# EasyEDA Pro project ProPrj_PomoDesk_V1.0.epro, board PCB1
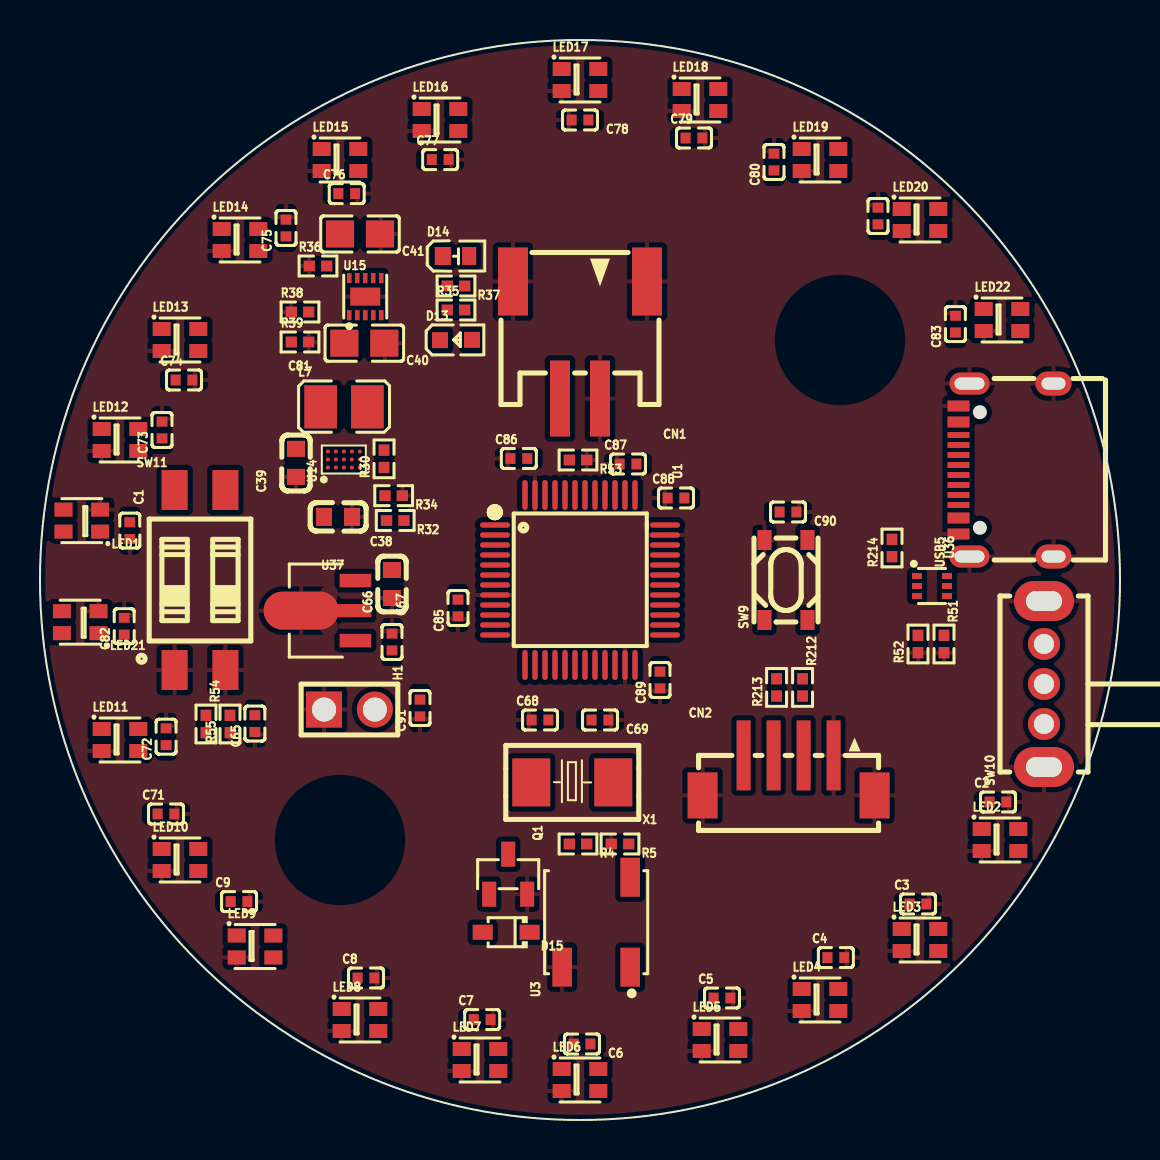
[diagram p5: board, top side]
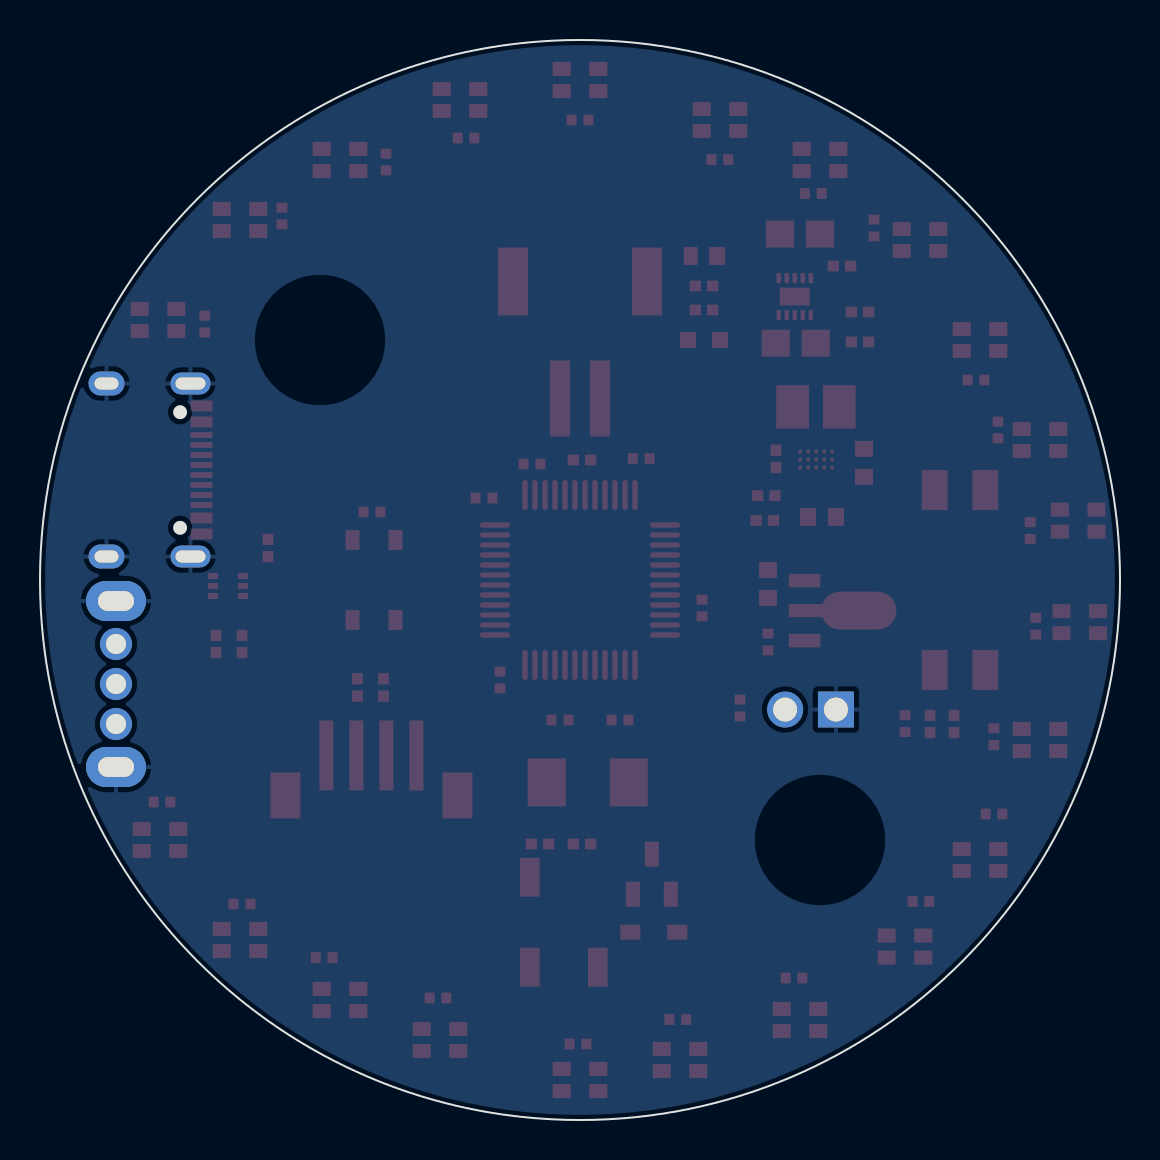
[diagram p6: board, bottom side, seen from below]

Outline 54 x 54 mm; copper layers: Top Layer, Inner1, Inner2, Bottom Layer. Coordinates in mm from the lower left corner of the outline.
Outline path: 0,27 arc(7.91,46.09) 27,54 arc(46.09,46.09) 54,27 arc(46.09,7.91) 27,0 arc(7.91,7.91) 0,27
Stack: Top Layer 0.035mm Outer layer thickness 1oz / Dielectric1 0.2104mm 7628 RC49% 8.6mil / Inner1 0.0152mm Inner layer thickness / Dielectric2 1.065mm 1.1mm H/HOZ Copper / Inner2 0.0152mm Inner layer thickness / Dielectric3 0.2104mm 7628 RC49% 8.6mil / Bottom Layer 0.035mm Outer layer thickness 1oz

## Design rules (mm)
template: JLCPCB Capability(Two Layers Board)
spacing copperThickness1oz (default): track to track 0.102, other pairs 0.152 to 0.3
spacing copperThickness2oz: track to track 0.203, other pairs 0.152 to 0.3
track width copperThickness1oz (default): min 0.127, default 0.254, max 2.54
track width copperThickness2oz: min 0.203, default 0.254, max 2.54
differential pair differentialPair (default): width min 0.127, default 0.254, max 2.54; gap min 0.152, default 0.152
via viaSize (default): diameter min 0.5, default 0.61, max 10; hole min 0.3, default 0.305, max 6.3

## Placement (name value [footprint] x y rotation side)
C1  100nF  [C0402]  4.49 29.47 270 top
C2  100nF  [C0402]  47.9 15.9 0 top
C3  100nF  [C0402]  43.9 10.8 0 top
C4  100nF  [C0402]  39.79 8.12 0 top
C5  100nF  [C0402]  34.1 6.1 0 top
C6  100nF  [C0402]  27.1 3.8 180 top
C7  100nF  [C0402]  22.11 5.02 0 top
C8  100nF  [C0402]  16.3 7.1 0 top
C9  100nF  [C0402]  9.95 10.92 0 top
C38  10uF  [C0603]  14.9 30.16 180 top
C39  22uF  [C0603]  12.8 32.86 90 top
C40  1uF  [C0805]  16.22 38.84 180 top
C41  1uF  [C0805]  16 44.3 180 top
C65  10nF  [C0402]  10.74 19.82 90 top
C66  330nF  [C0603]  17.6 26.8 90 top
C67  100nF  [C0402]  17.6 23.9 270 top
C68  20pF  [C0402]  25 20 0 top
C69  20pF  [C0402]  28 20 180 top
C71  100nF  [C0402]  6.3 15.3 0 top
C72  100nF  [C0402]  6.3 19.17 90 top
C73  100nF  [C0402]  6.1 34.5 90 top
C74  100nF  [C0402]  7.2 37 0 top
C75  100nF  [C0402]  12.3 44.6 90 top
C76  100nF  [C0402]  15.34 46.32 0 top
C77  100nF  [C0402]  20.01 48.02 0 top
C78  100nF  [C0402]  27 50 180 top
C79  100nF  [C0402]  32.7 49.1 0 top
C80  100nF  [C0402]  36.7 47.9 90 top
C81  100nF  [C0402]  41.9 45.2 90 top
C82  100nF  [C0402]  4.21 24.69 90 top
C83  100nF  [C0402]  45.77 39.8 90 top
C85  100nF  [C0402]  20.9 25.6 90 top
C86  100nF  [C0402]  23.94 33.08 0 top
C87  100nF  [C0402]  29.4 32.8 0 top
C88  100nF  [C0402]  31.8 31.1 0 top
C89  100nF  [C0402]  31 22 90 top
C90  100nF  [C0402]  37.4 30.4 180 top
C91  100nF  [C0402]  19 20.6 90 top
CN1  S2B-PH-SM4  [CONN-SMD_P2.00_S2B-PH-SM4-TB-LF-SN]  27 39 180 top
CN2  B4B-ZR-SM4-TFT(LF)(SN)  [CONN-TH_B4B-ZR-SM4-TFT-LF-SN]  37.43 17.23 0 top
D13  19-217/GHC-YR1S2/6T  [LED0603-RD_GREEN]  20.8 39 0 top
D14  19-217/BHC-ZL1M2RY/6T  [LED0603-R-RD_BLUE-A]  20.8 43.2 0 top
D15  1N4148WS  [SOD-323_L1.8-W1.3-LS2.5-RD]  23.31 9.39 180 top
H1  -  [HDR-TH_2P-P2.54-V-M-2]  15.47 20.52 270 top
L7  470nH  [L1008]  15.2 35.66 0 top
LED1  WS2812B-2020  [LED-SMD_4P-L2.0-W2.0-TL_WS2812B-2020]  2.09 29.97 180 top
LED2  WS2812B-2020  [LED-SMD_4P-L2.0-W2.0-TL_WS2812B-2020]  48 14 0 top
LED3  WS2812B-2020  [LED-SMD_4P-L2.0-W2.0-TL_WS2812B-2020]  44 9 0 top
LED4  WS2812B-2020  [LED-SMD_4P-L2.0-W2.0-TL_WS2812B-2020]  39 6 0 top
LED5  WS2812B-2020  [LED-SMD_4P-L2.0-W2.0-TL_WS2812B-2020]  34 4 0 top
LED6  WS2812B-2020  [LED-SMD_4P-L2.0-W2.0-TL_WS2812B-2020]  27 2 0 top
LED7  WS2812B-2020  [LED-SMD_4P-L2.0-W2.0-TL_WS2812B-2020]  22 3 0 top
LED8  WS2812B-2020  [LED-SMD_4P-L2.0-W2.0-TL_WS2812B-2020]  16 5 0 top
LED9  WS2812B-2020  [LED-SMD_4P-L2.0-W2.0-TL_WS2812B-2020]  10.75 8.67 0 top
LED10  WS2812B-2020  [LED-SMD_4P-L2.0-W2.0-TL_WS2812B-2020]  7 13 0 top
LED11  WS2812B-2020  [LED-SMD_4P-L2.0-W2.0-TL_WS2812B-2020]  4 19 0 top
LED12  WS2812B-2020  [LED-SMD_4P-L2.0-W2.0-TL_WS2812B-2020]  4 34 0 top
LED13  WS2812B-2020  [LED-SMD_4P-L2.0-W2.0-TL_WS2812B-2020]  7 39 0 top
LED14  WS2812B-2020  [LED-SMD_4P-L2.0-W2.0-TL_WS2812B-2020]  10 44 0 top
LED15  WS2812B-2020  [LED-SMD_4P-L2.0-W2.0-TL_WS2812B-2020]  15 48 0 top
LED16  WS2812B-2020  [LED-SMD_4P-L2.0-W2.0-TL_WS2812B-2020]  20 50 0 top
LED17  WS2812B-2020  [LED-SMD_4P-L2.0-W2.0-TL_WS2812B-2020]  27 52 0 top
LED18  WS2812B-2020  [LED-SMD_4P-L2.0-W2.0-TL_WS2812B-2020]  33 51 0 top
LED19  WS2812B-2020  [LED-SMD_4P-L2.0-W2.0-TL_WS2812B-2020]  39 48 0 top
LED20  WS2812B-2020  [LED-SMD_4P-L2.0-W2.0-TL_WS2812B-2020]  44 45 0 top
LED21  WS2812B-2020  [LED-SMD_4P-L2.0-W2.0-TL_WS2812B-2020]  2.01 24.89 180 top
LED22  WS2812B-2020  [LED-SMD_4P-L2.0-W2.0-TL_WS2812B-2020]  48.1 40 0 top
Q1  SS8050  [SOT-23-3_L2.9-W1.3-P1.90-LS2.4-BR]  23.41 12.29 270 top
R4  680Ω  [R0402]  26.9 13.8 180 top
R5  47kΩ  [R0402]  29 13.8 180 top
R30  100kΩ  [R0402]  17.2 33.06 90 top
R32  806kΩ  [R0402]  17.76 29.98 180 top
R34  91kΩ  [R0402]  17.68 31.22 180 top
R35  1.5kΩ  [R0402]  20.8 40.5 0 top
R36  10kΩ  [R0402]  13.9 42.7 0 top
R37  1.5kΩ  [R0402]  20.8 41.7 180 top
R38  680Ω  [R0402]  13 40.4 0 top
R39  2kΩ  [R0402]  13 38.9 0 top
R51  5k1Ω  [R0402]  45.2 23.8 270 top
R52  5k1Ω  [R0402]  43.9 23.8 90 top
R53  10kΩ  [R0402]  26.9 33 180 top
R54  1MΩ  [R0402]  8.3 19.8 270 top
R55  1MΩ  [R0402]  9.5 19.8 90 top
R212  22Ω  [R0402]  38.13 21.63 270 top
R213  22Ω  [R0402]  36.83 21.63 90 top
R214  1.5kΩ  [R0402]  42.6 28.6 90 top
SW9  RESET BUTTON  [SW-SMD_4P-L4.2-W3.2-P2.15-LS4.5]  37.3 27 90 top
SW10  SK12D07VG5  [SW-TH_SK12D07VG5-1]  50.2 21.8 90 top
SW11  DSIC02LS-P  [SW-SMD_4P-L5.1-W6.1-P2.54-LS9.8]  8 27 0 top
U1  STM32F103C8T6  [LQFP-48_L7.0-W7.0-P0.50-LS9.0-BL]  27 27 270 top
U3  KLJ-5020  [BUZ-SMD_4P-L5.0-W5.0-P3.80-TL]  27.81 9.89 90 top
U14  TPS63805YFFR  [DSBGA-15_L2.3-W1.3-R5-C3-P0.40-TL]  15.19 33.02 90 top
U15  BQ24040DSQR  [WSON-10_L2.0-W2.0-P0.40-BL-EP]  16.26 41.17 0 top
U36  USBLC6-2P6  [SOT-666-6_L1.6-W1.2-P0.50-LS1.6-BL]  44.6 26.7 270 top
U37  78L05  [SOT-89-3_L4.5-W2.5-P1.50-LS4.2-BR]  14.41 25.47 0 top
USB5  TYPE-C 16PIN 2MD(073)  [USB-C-SMD_TYPE-C-6PIN-2MD-073]  48.3 32.5 90 top
X1  8MHz  [CRYSTAL-SMD_L5.0-W3.2]  26.61 16.88 180 top

## Footprints (pads in the part's own frame, mm; a bottom-side part is the same pattern mirrored in y, then rotated)
BUZ-SMD_4P-L5.0-W5.0-P3.80-TL
  rect 1.945x0.98 smd: 1(-2.248,-1.7) 2(2.248,-1.7) 3(-2.248,1.7)
C0402
  rect 0.5x0.54 smd: 1(-0.42,0) 2(0.42,0)
C0603
  rect 0.8x0.9 smd: 1(-0.7,0) 2(0.7,0)
C0805
  rect 1.41x1.35 smd: 1(-1,0) 2(1,0)
CONN-SMD_P2.00_S2B-PH-SM4-TB-LF-SN
  rect 1x3.8 smd: 1(-1,2.925) 2(1,2.925)
  rect 1.5x3.4 smd: 3(3.35,-2.925) 4(-3.35,-2.925)
CONN-TH_B4B-ZR-SM4-TFT-LF-SN
  rect 0.7x3.5 smd: 1(2.25,1) 2(0.75,1) 3(-0.75,1) 4(-2.25,1)
  rect 1.5x2.3 smd: 5(-4.3,-1) 6(4.3,-1)
CRYSTAL-SMD_L5.0-W3.2
  rect 1.9x2.4 smd: 1(-2.05,0) 2(2.05,0)
DSBGA-15_L2.3-W1.3-R5-C3-P0.40-TL
  round 0.2 smd: A1(-0.4,0.8) A2(0,0.8) A3(0.4,0.8) B1(-0.4,0.4) B2(0,0.4) B3(0.4,0.4) C1(-0.4,0) C2(0,0) C3(0.4,0) D1(-0.4,-0.4) D2(0,-0.4) D3(0.4,-0.4) E1(-0.4,-0.8) E2(0,-0.8) E3(0.4,-0.8)
HDR-TH_2P-P2.54-V-M-2
  rect 1.8x1.8 hole 1.2: 1(0,-1.27)
  round 1.8 hole 1.2: 2(0,1.27)
L1008
  rect 1.635x2.16 smd: 1(-1.167,0) 2(1.167,0)
LED0603-R-RD_BLUE-A
  rect 0.7x0.9 smd: 1(0.66,0)
  rect 0.8x0.9 smd: 2(-0.66,0)
LED0603-RD_GREEN
  rect 0.8x0.8 smd: 1(-0.799,-0.004) 2(0.799,0.004)
LED-SMD_4P-L2.0-W2.0-TL_WS2812B-2020
  rect 0.9x0.7 smd: 1(-0.915,0.55) 2(-0.915,-0.55) 3(0.915,-0.55) 4(0.915,0.55)
LQFP-48_L7.0-W7.0-P0.50-LS9.0-BL
  oval 0.27x1.5 smd: 1(-2.75,-4.25) 2(-2.25,-4.25) 3(-1.75,-4.25) 4(-1.25,-4.25) 5(-0.75,-4.25) 6(-0.25,-4.25) 7(0.25,-4.25) 8(0.75,-4.25) 9(1.25,-4.25) 10(1.75,-4.25) 11(2.25,-4.25) 12(2.75,-4.25) 25(2.75,4.25) 26(2.25,4.25) 27(1.75,4.25) 28(1.25,4.25) 29(0.75,4.25) 30(0.25,4.25) 31(-0.25,4.25) 32(-0.75,4.25) 33(-1.25,4.25) 34(-1.75,4.25) 35(-2.25,4.25) 36(-2.75,4.25)
  oval 1.5x0.27 smd: 13(4.25,-2.75) 14(4.25,-2.25) 15(4.25,-1.75) 16(4.25,-1.25) 17(4.25,-0.75) 18(4.25,-0.25) 19(4.25,0.25) 20(4.25,0.75) 21(4.25,1.25) 22(4.25,1.75) 23(4.25,2.25) 24(4.25,2.75) 37(-4.25,2.75) 38(-4.25,2.25) 39(-4.25,1.75) 40(-4.25,1.25) 41(-4.25,0.75) 42(-4.25,0.25) 43(-4.25,-0.25) 44(-4.25,-0.75) 45(-4.25,-1.25) 46(-4.25,-1.75) 47(-4.25,-2.25) 48(-4.25,-2.75)
R0402
  rect 0.566x0.54 smd: 1(-0.433,0) 2(0.433,0)
SOD-323_L1.8-W1.3-LS2.5-RD
  rect 1x0.75 smd: 1(-1.173,0) 2(1.173,0)
SOT-23-3_L2.9-W1.3-P1.90-LS2.4-BR
  rect 1.25x0.7 smd: 1(1,-0.95) 2(1,0.95) 3(-1,0)
SOT-89-3_L4.5-W2.5-P1.50-LS4.2-BR
  rect 1.575x0.672 smd: 1(1.356,-1.5) 3(1.356,1.5)
  custom 5.377x1.9 smd: 2(-1.356,0)
SOT-666-6_L1.6-W1.2-P0.50-LS1.6-BL
  rect 0.3x0.5 smd: 1(-0.5,-0.75) 2(0,-0.75) 3(0.5,-0.75) 4(0.5,0.75) 5(0,0.75) 6(-0.5,0.75)
SW-SMD_4P-L4.2-W3.2-P2.15-LS4.5
  rect 1x0.7 smd: 1(-2,1.075) 2(2,1.075) 3(-2,-1.075) 4(2,-1.075)
SW-SMD_4P-L5.1-W6.1-P2.54-LS9.8
  rect 1.3x2 smd: 1(-1.27,-4.5) 2(1.27,-4.5) 3(1.27,4.5) 4(-1.27,4.5)
SW-TH_SK12D07VG5-1
  oval 1.6x1.6 hole 1: 1(-2,0) 2(0,0) 3(2,0)
  oval 2x3 hole 1x1.8: 4(4.15,0) 5(-4.15,0)
USB-C-SMD_TYPE-C-6PIN-2MD-073
  rect 0.55x1.1 smd: 1(-3.2,2.375) 2(-2.4,2.375) 11(2.4,2.375) 12(3.2,2.375)
  rect 0.3x1.1 smd: 3(-1.75,2.375) 4(-1.25,2.375) 5(-0.75,2.375) 6(-0.25,2.375) 7(0.25,2.375) 8(0.75,2.375) 9(1.25,2.375) 10(1.75,2.375)
  oval 1.1x2 hole 0.6x1.5: 13(-4.325,1.825) 14(4.325,1.825)
  oval 1.2x1.8 hole 0.6x1.2: 13(-4.325,-2.375) 14(4.325,-2.375)
WSON-10_L2.0-W2.0-P0.40-BL-EP
  rect 0.224x0.505 smd: 1(-0.8,-0.927) 2(-0.4,-0.927) 3(0,-0.927) 4(0.4,-0.927) 5(0.8,-0.927) 6(0.8,0.927) 7(0.4,0.927) 8(0,0.927) 9(-0.4,0.927) 10(-0.8,0.927)
  rect 1.5x0.9 smd: 11(0,0)

## Nets
As in the schematic.

Pads without a net: LED22 1; SW9 1 4; SW10 1; U1 2 3 4 11 12 13 15 17 20 21 22 25 26 27 28 30 31 38 39 40 41 42 43 45 46; U15 6; USB5 3 9

## Copper pours and planes (outline as drawn; the poured copper is in the pictures)
GND on Top Layer: -5,59 60,59 60,-6 -5,-6
GND on Bottom Layer: -4,58 59,58 59,-3 -4,-3
GND on Inner1: -2,57 61,57 61,-5 -2,-5
GND on Inner2: -1,56 63,56 63,-7 -1,-7
